# EAGLE design door-sensor (EAGLE 8.6.0)
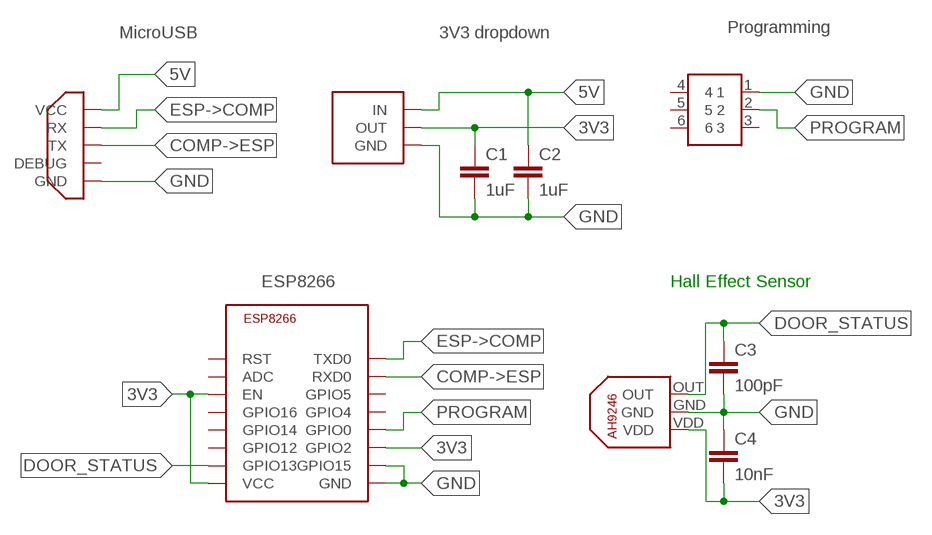
[diagram p0: schematic, sheet 1]

## Parts
C1  1uF  C-EUC0805  [C0805]
C2  1uF  C-EUC0805  [C0805]
C3  100pF  C-EUC0805  [C0805]
C4  10nF  C-EUC0805  [C0805]
U$2  MICROUSB609-4613-1-ND  [MICROUSB]
U$4  AZ1117E  [SOT-223]
U$6  ESP8266-12E-SMD  [ESP8266-12E-SMD]
U$7  AYZ0202AGRL  [AYZ0202AGRL]
U$8  AH9246SC59  [SC59]

## Nets
3V3: C1.1 C4.2 U$4.P$1(OUT) U$4.P$2(OUT) U$6.EN U$6.GPIO2 U$6.VCC U$8.VDD
5V: C2.1 U$2.VCC U$4.P$4(IN)
COMP->ESP: U$2.TX U$6.RXD0
DOOR_STATUS: C3.1 U$6.GPIO13 U$8.OUT
ESP->COMP: U$2.RX U$6.TXD0
GND: C1.2 C2.2 C3.2 C4.1 U$2.GND U$4.P$3(GND) U$6.GND U$6.GPIO15 U$7.1 U$8.GND
PROGRAM: U$6.GPIO0 U$7.2
Unconnected: U$2.DEBUG U$6.ADC U$6.GPIO4 U$6.GPIO5 U$6.GPIO12 U$6.GPIO14 U$6.GPIO16 U$6.RST U$7.3 U$7.4 U$7.5 U$7.6

## Notes on the sheet
- Programming
- MicroUSB | 3V3 dropdown
- ESP8266 | Hall Effect Sensor

## Library data of the parts
C1-C4 = rcl:C-EU: CAPACITOR, European symbol; SPICEPREFIX: C
U$2 = idiotic-connectors:MICROUSB
U$4 = idiotic-regulators:AZ1117E: AZ1117E - 3.3 volt regulator Technical Specifications: Max Current 1.3 A Connect 1.0 uF cap from GND to IN Connect 1.0 uF cap from GND to OUT
U$6 = idiotic-microcontrollers:ESP8266
U$7 = idiotic-switches:AYZ0202AGRL
U$8 = idiotic-sensors:AH9246

## Board
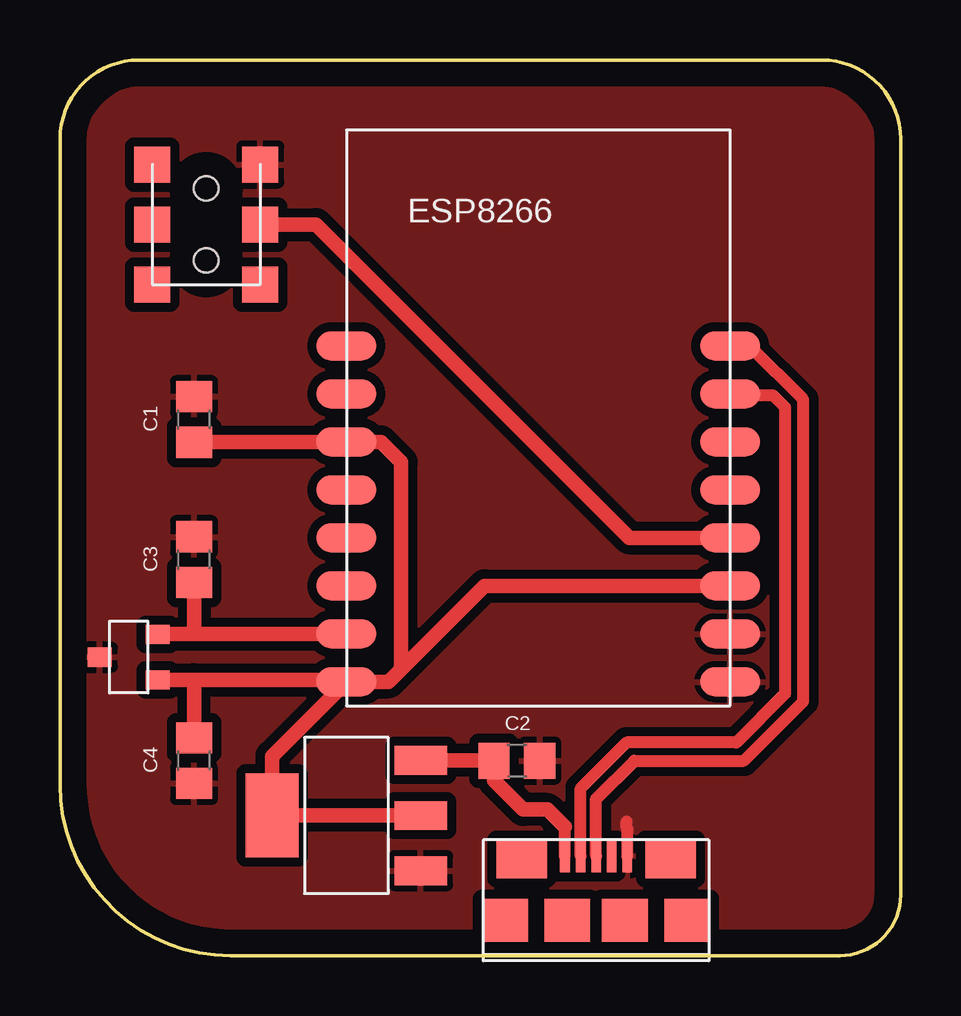
[diagram p1: board, top side]
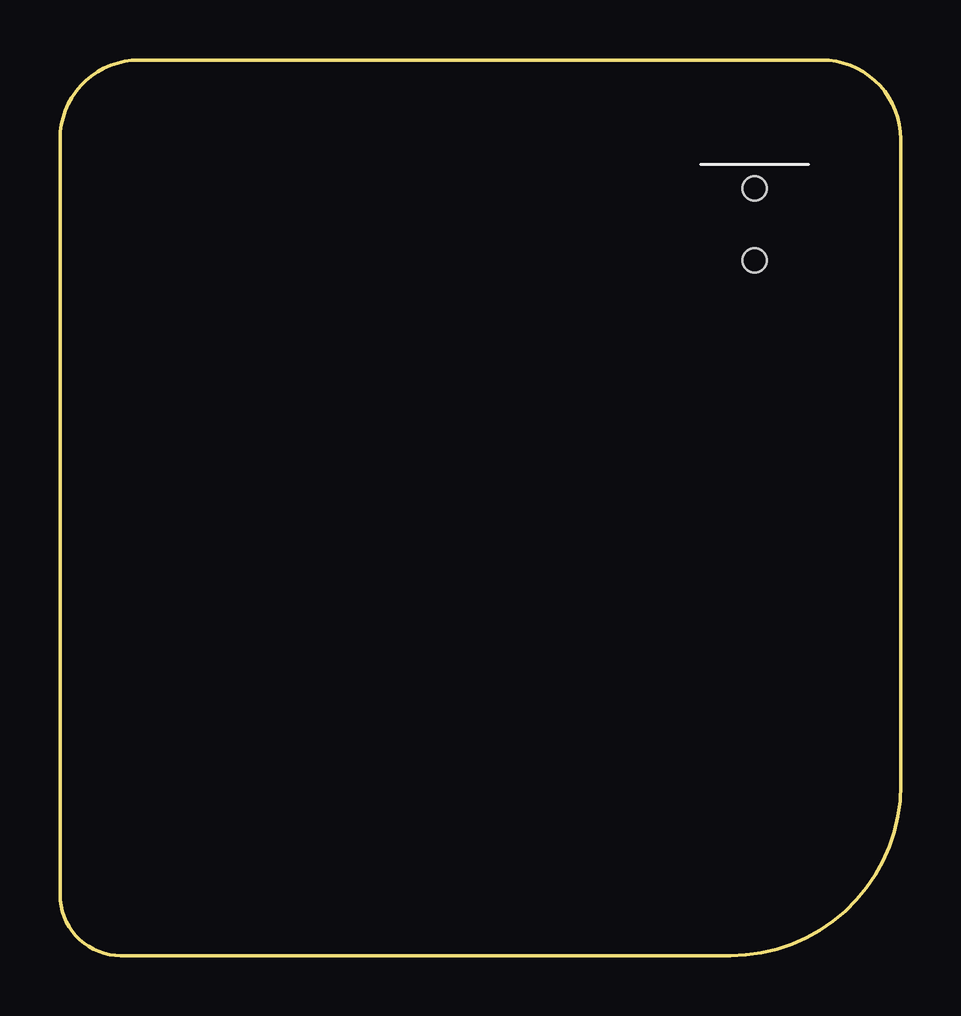
[diagram p2: board, bottom side, seen from below]

Size 35.05 x 37.34 mm. Coordinates in mm from the lower left corner, seen from the top.
Outline: 7.11,0 arc-90 0,7.11 0,34.04 arc-90 3.3,37.34 31.75,37.34 arc-90 35.05,34.04 35.05,2.54 arc-90 32.51,0 7.11,0
Copper layers (1*16): Top 0.035mm / dielectric 1.5mm / Bottom 0.035mm
Design rules "default *": minimum track width 6mil, minimum drill 0.35mm, track to track 10mil, track to pad 6mil, pad to pad 6mil, via to via 6mil, smd to smd 6mil, copper to edge 40mil, drill to drill 6mil, minimum pad ring 10mil, minimum via ring 8mil, stop-mask expansion 4mil, vias tented up to drill 0mil, thermal gap 10mil

### Footprints (pad centres in the part's own frame; a part is rotated, then mirrored left to right if it is on the bottom)
C0805 = smd 1.3 x 1.5: 1 -0.95,0; 2 0.95,0
MICROUSB = smd 0.4 x 1.35: DEBUG -0.65,0.675; GND -1.3,0.675; RX 0,0.675; TX 0.65,0.675; VCC 1.3,0.675 | smd 2.1 x 1.6: P$1 3.1,0.8; P$6 -3.1,0.8 | smd 1.9 x 1.8: P$2 3.8,3.35; P$3 -3.8,3.35; P$5 -1.2,3.35; P$7 1.2,3.35
SOT-223 = smd 3.5 x 2.2: P$1 0,3.1 | smd 1.2 x 2.2: P$2 0,-3.1; P$3 -2.3,-3.1; P$4 2.3,-3.1
ESP8266-12E-SMD = smd 2.5 x 1.2: ADC 0,13; EN 0,11; GND 16,1; GPIO0 16,7; GPIO2 16,5; GPIO4 16,9; GPIO5 16,11; GPIO12 0,5; GPIO13 0,3; GPIO14 0,7; GPIO15 16,3; GPIO16 0,9; RST 0,15; RXD0 16,13; TXD0 16,15; VCC 0,1
AYZ0202AGRL = smd 1.5 x 1.5: 1 -2.5,2.25; 2 0,2.25; 3 2.5,2.25; 4 -2.5,-2.25; 5 0,-2.25; 6 2.5,-2.25 | hole 1.016: -1.5,0; 1.5,0
SC59 = smd 0.8 x 1: GND 0,2.4; OUT 0.95,0; VDD -0.95,0

### Placement (x,y rotation side)
C1  5.59,22.35 90 top
C2  19.05,8.13 0 top
C3  5.59,16.51 90 top
C4  5.59,8.13 90 top
U$2  22.35,4.83 180 top
U$4  11.94,5.84 90 top
U$6  11.94,10.41 0 top
U$7  6.1,30.48 270 top
U$8  4.06,12.45 90 top

### Tracks (layer width: path | path; a pad name or v marks a point on that pad's centre or on a via)
3V3
  Top 0.61: U$4.P$2 U$4.P$1 8.84,8.31 U$6.VCC | U$6.VCC 13.7,11.41 14.22,11.94 | 14.22,11.94 14.22,20.57 13.38,21.41 U$6.EN 11.86,21.34 11.79,21.4 C1.1 | 14.22,11.94 17.7,15.41 U$6.GPIO2 | U$8.VDD 5.59,11.5 | 5.59,11.5 11.86,11.5 U$6.VCC | C4.2 5.59,11.5
5V
  Top 0.508: U$2.VCC 21.05,5.36
  Top 0.61: U$4.P$4 18.09,8.14 C2.1 18.1,7.3 19.3,6.1 20.32,6.1 21.05,5.36
COMP->ESP
  Top 0.508: U$6.RXD0 27.98,23.37 29.72,23.37 30.23,22.86 30.23,10.92 28.19,8.89 23.62,8.89 21.7,6.97 U$2.TX
DOOR_STATUS
  Top 0.61: U$8.OUT 4.08,13.41 5.59,13.41 | 5.59,13.41 U$6.GPIO13 | C3.1 5.59,13.41
ESP->COMP
  Top 0.508: U$2.RX 22.35,6.54 23.94,8.13 28.51,8.13 30.99,10.61 30.99,23.18 28.75,25.41 U$6.TXD0
GND
  Top 0.508: U$2.GND 23.65,5.3 23.62,5.33 23.62,5.59
  pour Top (isolate 0.381): 1.02,33.53 1.02,7.87 arc90 7.11,1.02 32.26,1.02 arc90 34.04,2.79 34.04,33.27 arc90 31.24,36.32 3.81,36.32 arc90
PROGRAM
  Top 0.61: U$7.2 10.67,30.48 23.73,17.41 U$6.GPIO0